# Altium schematic sheet STM32H730_PINOUT.SchDoc
size C; SheetNumber: 5; SheetTotal: 5
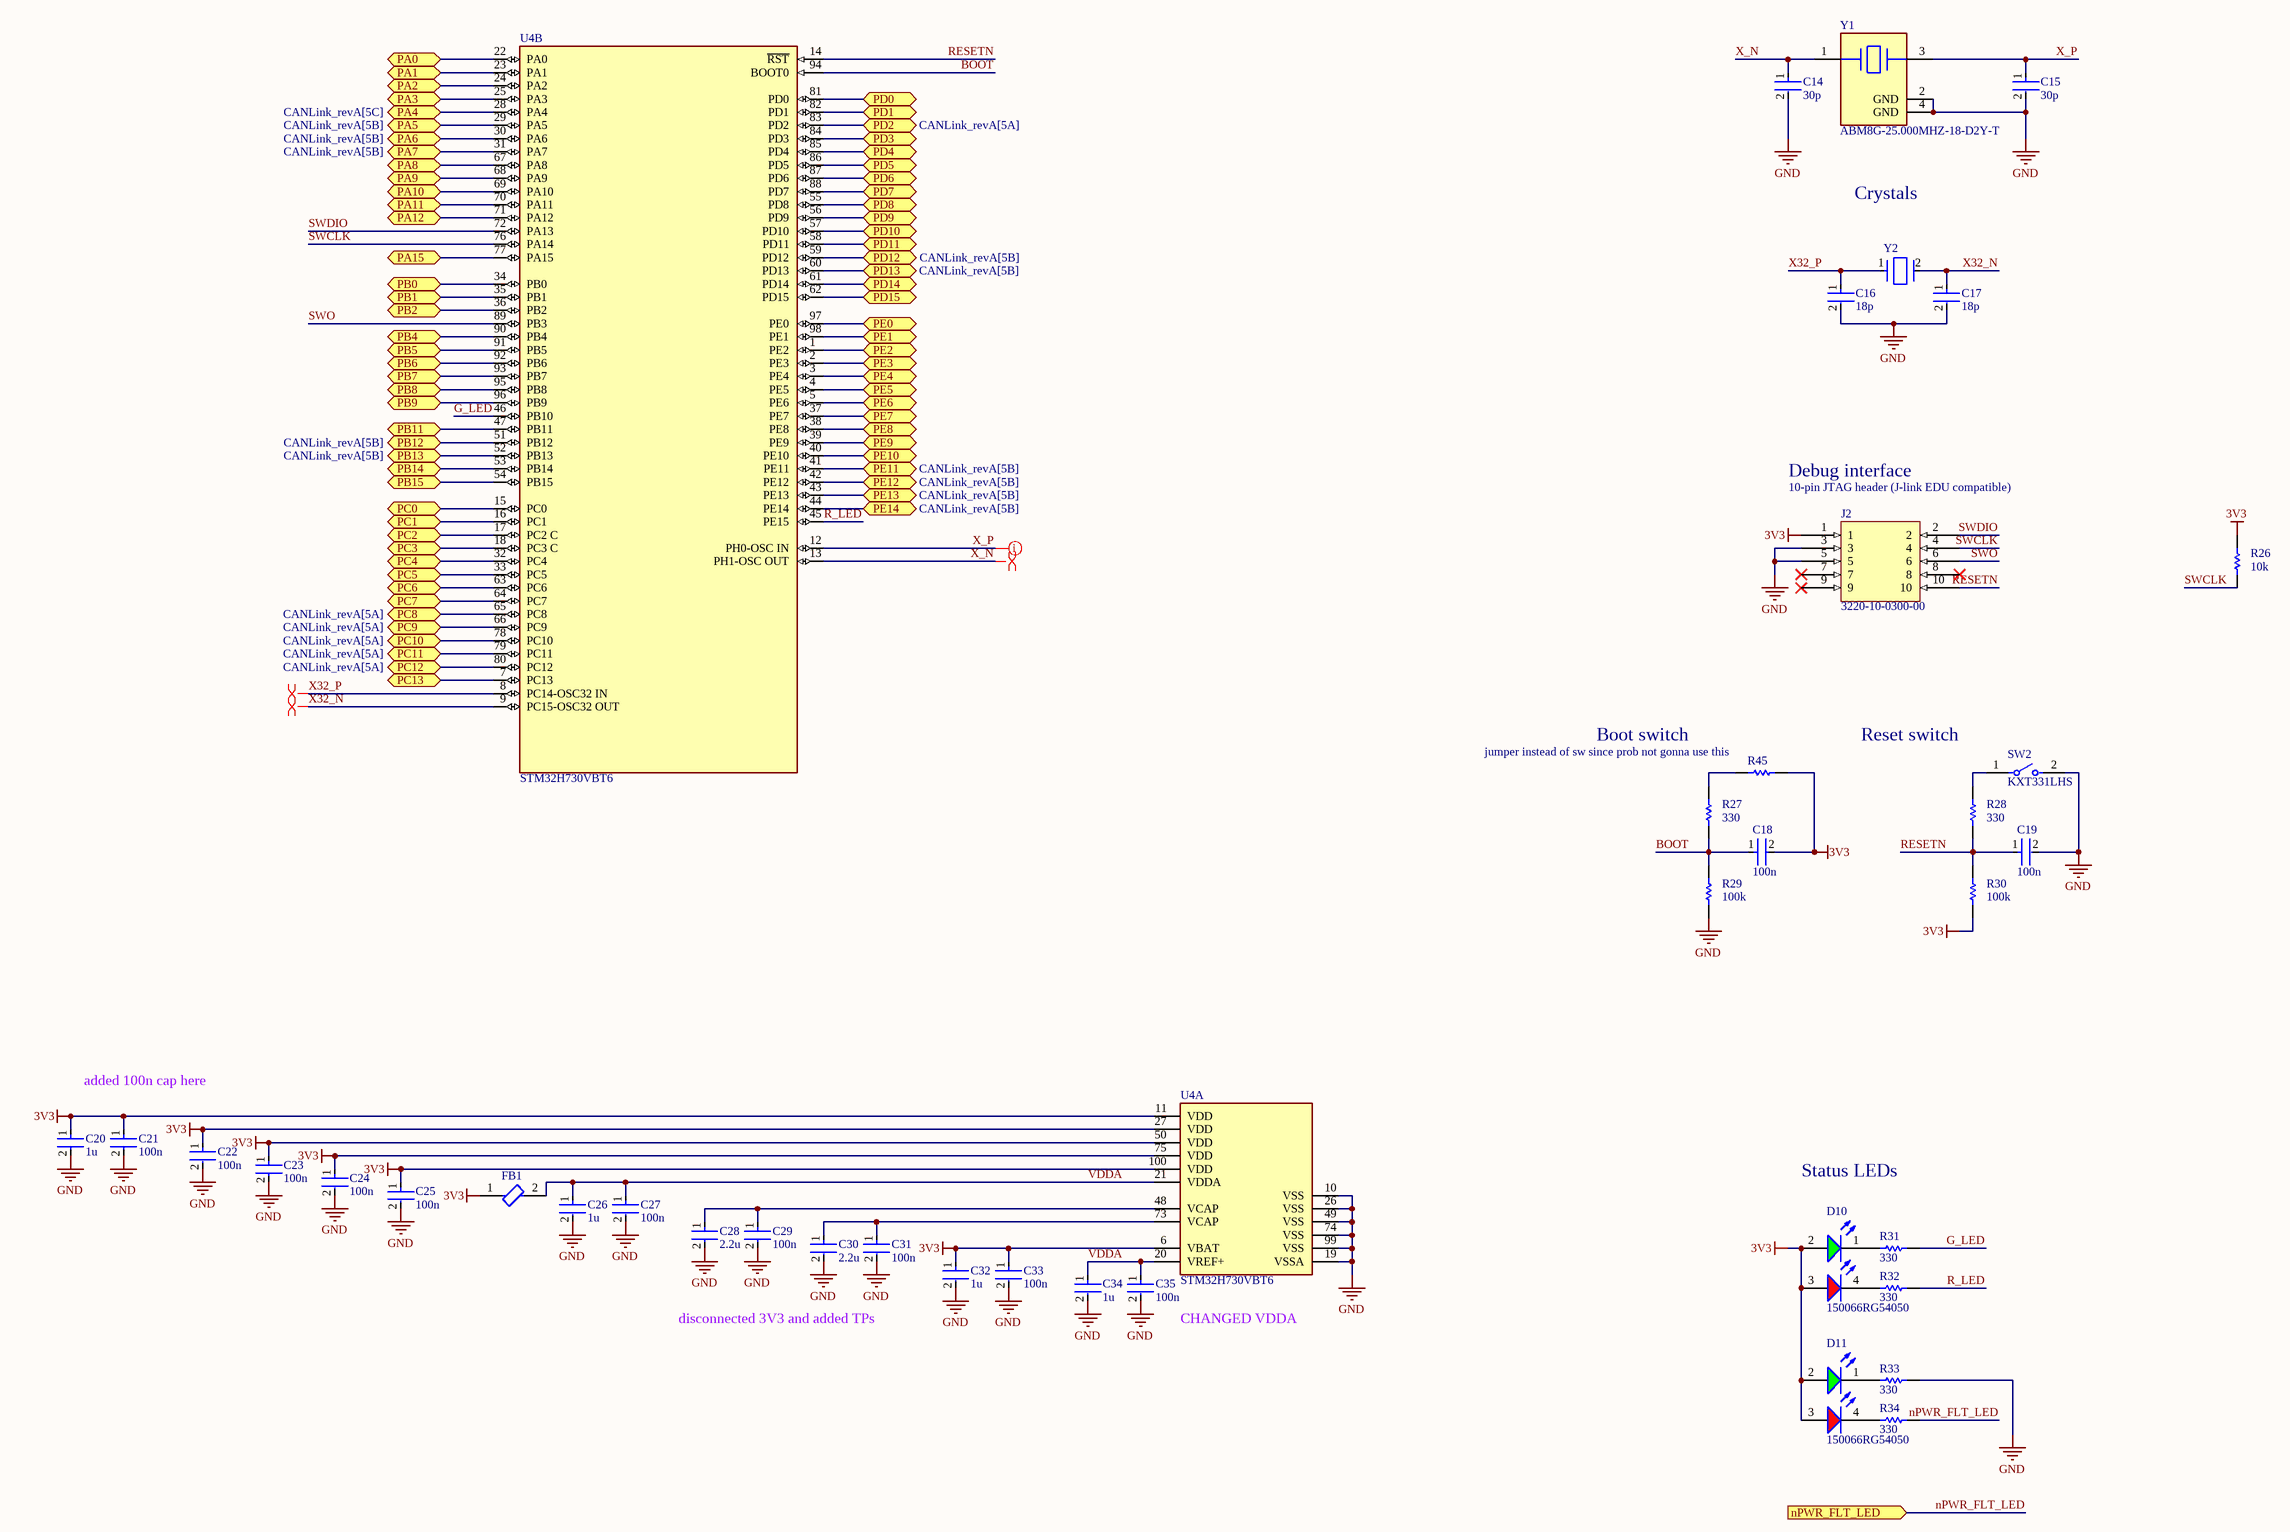
[diagram p0: STM32H730_PINOUT.SchDoc]

## Parts
C14  30p  [FP-0402-L_1_0_0_05-W_0_5-IPC_A]
C15  30p  [FP-0402-L_1_0_0_05-W_0_5-IPC_A]
C16  18p  [FP-0402-L_1_0_0_05-W_0_5-IPC_A]
C17  18p  [FP-0402-L_1_0_0_05-W_0_5-IPC_A]
C18  100n  [FP-0402-L_1_0_0_05-W_0_5-IPC_A]
C19  100n  [FP-0402-L_1_0_0_05-W_0_5-IPC_A]
C20  1u  [FP-0402-L_1_0_0_05-W_0_5-IPC_A]
C21  100n  [FP-0402-L_1_0_0_05-W_0_5-IPC_A]
C22  100n  [FP-0402-L_1_0_0_05-W_0_5-IPC_A]
C23  100n  [FP-0402-L_1_0_0_05-W_0_5-IPC_A]
C24  100n  [FP-0402-L_1_0_0_05-W_0_5-IPC_A]
C25  100n  [FP-0402-L_1_0_0_05-W_0_5-IPC_A]
C26  1u  [FP-0402-L_1_0_0_05-W_0_5-IPC_A]
C27  100n  [FP-0402-L_1_0_0_05-W_0_5-IPC_A]
C28  2.2u  [FP-0402-L_1_0_0_05-W_0_5-IPC_A]
C29  100n  [FP-0402-L_1_0_0_05-W_0_5-IPC_A]
C30  2.2u  [FP-0402-L_1_0_0_05-W_0_5-IPC_A]
C31  100n  [FP-0402-L_1_0_0_05-W_0_5-IPC_A]
C32  1u  [FP-0402-L_1_0_0_05-W_0_5-IPC_A]
C33  100n  [FP-0402-L_1_0_0_05-W_0_5-IPC_A]
C34  1u  [FP-0402-L_1_0_0_05-W_0_5-IPC_A]
C35  100n  [FP-0402-L_1_0_0_05-W_0_5-IPC_A]
D10  150066RG54050  [WL-SBCD_0606]
D11  150066RG54050  [WL-SBCD_0606]
FB1  BLM15PX601SN1D  [FP-BLM15-0_05-IPC_A]  (value not drawn)
J2  3220-10-0300-00  [3220-10-0300-00-Footprint-1]
R26  10k  [R0603B]
R27  330  [R0603B]
R28  330  [R0603B]
R29  100k  [R0603B]
R30  100k  [R0603B]
R31  330  [R0603B]
R32  330  [R0603B]
R33  330  [R0603B]
R34  330  [R0603B]
R45  0402 JUMPER  [RESC1005X40X25ML05T05]  (value not drawn)
SW2  KXT331LHS  [FP-KXT331LHS-MFG]
U4  STM32H730VBT6  [FP-LQFP100-1L-IPC_C]  (parts A,B of 2)
Y1  ABM8G-25.000MHZ-18-D2Y-T  [FP-ABM8G-MFG]
Y2  ECS-.327-12.5-1210-TR  [FP-ECX-1210-MFG]  (value not drawn)

## Ports
nPWR_FLT_LED (in), PA0 (bidir), PA1 (bidir), PA2 (bidir), PA3 (bidir), PA4 (bidir, see CANLink_revA[5C]), PA5 (bidir, see CANLink_revA[5B]), PA6 (bidir, see CANLink_revA[5B]), PA7 (bidir, see CANLink_revA[5B]), PA8 (bidir), PA9 (bidir), PA10 (bidir), PA11 (bidir), PA12 (bidir), PA15 (bidir), PB0 (bidir), PB1 (bidir), PB2 (bidir), PB4 (bidir), PB5 (bidir), PB6 (bidir), PB7 (bidir), PB8 (bidir), PB9 (bidir), PB11 (bidir), PB12 (bidir, see CANLink_revA[5B]), PB13 (bidir, see CANLink_revA[5B]), PB14 (bidir), PB15 (bidir), PC0 (bidir), PC1 (bidir), PC2 (bidir), PC3 (bidir), PC4 (bidir), PC5 (bidir), PC6 (bidir), PC7 (bidir), PC8 (bidir, see CANLink_revA[5A]), PC9 (bidir, see CANLink_revA[5A]), PC10 (bidir, see CANLink_revA[5A]), PC11 (bidir, see CANLink_revA[5A]), PC12 (bidir, see CANLink_revA[5A]), PC13 (bidir), PD0 (bidir), PD1 (bidir), PD2 (bidir, see CANLink_revA[5A]), PD3 (bidir), PD4 (bidir), PD5 (bidir), PD6 (bidir), PD7 (bidir), PD8 (bidir), PD9 (bidir), PD10 (bidir), PD11 (bidir), PD12 (bidir, see CANLink_revA[5B]), PD13 (bidir, see CANLink_revA[5B]), PD14 (bidir), PD15 (bidir), PE0 (bidir), PE1 (bidir), PE2 (bidir), PE3 (bidir), PE4 (bidir), PE5 (bidir), PE6 (bidir), PE7 (bidir), PE8 (bidir), PE9 (bidir), PE10 (bidir), PE11 (bidir, see CANLink_revA[5B]), PE12 (bidir, see CANLink_revA[5B]), PE13 (bidir, see CANLink_revA[5B]), PE14 (bidir, see CANLink_revA[5B])

## Nets
3V3: C18.2 C20.1 C21.1 C22.1 C23.1 C24.1 C25.1 C32.1 C33.1 D10.2(A) D10.3(A) D11.2(A) D11.3(A) FB1.1 J2.1 R26.2 R30.1 R45.2 U4.6(VBAT) U4.11(VDD) U4.27(VDD) U4.50(VDD) U4.75(VDD) U4.100(VDD)
GND: C14.2 C15.2 C16.2 C17.2 C19.2 C20.2 C21.2 C22.2 C23.2 C24.2 C25.2 C26.2 C27.2 C28.2 C29.2 C30.2 C31.2 C32.2 C33.2 C34.2 C35.2 J2.3 J2.5 R29.1 R33.1 SW2.2 U4.10(VSS) U4.19(VSSA) U4.26(VSS) U4.49(VSS) U4.74(VSS) U4.99(VSS) Y1.2(GND) Y1.4(GND)
BOOT: C18.1 R27.1 R29.2 U4.94(BOOT0)
G_LED: R31.1 U4.46(PB10)
nPWR_FLT_LED: R34.1 ; port nPWR_FLT_LED
PA0: U4.22(PA0) ; port PA0
PA1: U4.23(PA1) ; port PA1
PA2: U4.24(PA2) ; port PA2
PA3: U4.25(PA3) ; port PA3
PA4: U4.28(PA4) ; port PA4
PA5: U4.29(PA5) ; port PA5
PA6: U4.30(PA6) ; port PA6
PA7: U4.31(PA7) ; port PA7
PA8: U4.67(PA8) ; port PA8
PA9: U4.68(PA9) ; port PA9
PA10: U4.69(PA10) ; port PA10
PA11: U4.70(PA11) ; port PA11
PA12: U4.71(PA12) ; port PA12
PA15: U4.77(PA15) ; port PA15
PB0: U4.34(PB0) ; port PB0
PB1: U4.35(PB1) ; port PB1
PB2: U4.36(PB2) ; port PB2
PB4: U4.90(PB4) ; port PB4
PB5: U4.91(PB5) ; port PB5
PB6: U4.92(PB6) ; port PB6
PB7: U4.93(PB7) ; port PB7
PB8: U4.95(PB8) ; port PB8
PB9: U4.96(PB9) ; port PB9
PB11: U4.47(PB11) ; port PB11
PB12: U4.51(PB12) ; port PB12
PB13: U4.52(PB13) ; port PB13
PB14: U4.53(PB14) ; port PB14
PB15: U4.54(PB15) ; port PB15
PC0: U4.15(PC0) ; port PC0
PC1: U4.16(PC1) ; port PC1
PC2: U4.17(PC2_C) ; port PC2
PC3: U4.18(PC3_C) ; port PC3
PC4: U4.32(PC4) ; port PC4
PC5: U4.33(PC5) ; port PC5
PC6: U4.63(PC6) ; port PC6
PC7: U4.64(PC7) ; port PC7
PC8: U4.65(PC8) ; port PC8
PC9: U4.66(PC9) ; port PC9
PC10: U4.78(PC10) ; port PC10
PC11: U4.79(PC11) ; port PC11
PC12: U4.80(PC12) ; port PC12
PC13: U4.7(PC13) ; port PC13
PD0: U4.81(PD0) ; port PD0
PD1: U4.82(PD1) ; port PD1
PD2: U4.83(PD2) ; port PD2
PD3: U4.84(PD3) ; port PD3
PD4: U4.85(PD4) ; port PD4
PD5: U4.86(PD5) ; port PD5
PD6: U4.87(PD6) ; port PD6
PD7: U4.88(PD7) ; port PD7
PD8: U4.55(PD8) ; port PD8
PD9: U4.56(PD9) ; port PD9
PD10: U4.57(PD10) ; port PD10
PD11: U4.58(PD11) ; port PD11
PD12: U4.59(PD12) ; port PD12
PD13: U4.60(PD13) ; port PD13
PD14: U4.61(PD14) ; port PD14
PD15: U4.62(PD15) ; port PD15
PE0: U4.97(PE0) ; port PE0
PE1: U4.98(PE1) ; port PE1
PE2: U4.1(PE2) ; port PE2
PE3: U4.2(PE3) ; port PE3
PE4: U4.3(PE4) ; port PE4
PE5: U4.4(PE5) ; port PE5
PE6: U4.5(PE6) ; port PE6
PE7: U4.37(PE7) ; port PE7
PE8: U4.38(PE8) ; port PE8
PE9: U4.39(PE9) ; port PE9
PE10: U4.40(PE10) ; port PE10
PE11: U4.41(PE11) ; port PE11
PE12: U4.42(PE12) ; port PE12
PE13: U4.43(PE13) ; port PE13
PE14: U4.44(PE14) ; port PE14
R_LED: R32.1 U4.45(PE15)
RESETN: C19.1 J2.10 R28.1 R30.2 U4.14(~{RST})
SWCLK: J2.4 R26.1 U4.76(PA14)
SWDIO: J2.2 U4.72(PA13)
SWO: J2.6 U4.89(PB3)
VDDA: C26.1 C27.1 C34.1 C35.1 FB1.2 U4.20(VREF+) U4.21(VDDA)
X32_N: C17.1 U4.9(PC15-OSC32_OUT) Y2.2(Out/In)
X32_P: C16.1 U4.8(PC14-OSC32_IN) Y2.1(In/Out)
X_N: C14.1 U4.13(PH1-OSC_OUT) Y1.1
X_P: C15.1 U4.12(PH0-OSC_IN) Y1.3
NetC28_1: C28.1 C29.1 U4.48(VCAP)
NetC30_1: C30.1 C31.1 U4.73(VCAP)
NetD10_1: D10.1(K) R31.2
NetD10_4: D10.4(K) R32.2
NetD11_1: D11.1(K) R33.2
NetD11_4: D11.4(K) R34.2
NetR27_2: R27.2 R45.1
NetR28_2: R28.2 SW2.1

Not connected (* = marked no-connect by the designer): J2 7* 8* 9*

## Layout directives
differential pair: X32_N, X32_P, X_N, X_P

## Notes on the sheet
- Crystals
- Debug interface
- (near J2) 10-pin JTAG header (J-link EDU compatible)
- Boot switch
- Reset switch
- (near R45) jumper instead of sw since prob not gonna use this
- added 100n cap here
- Status LEDs
- disconnected 3V3 and added TPs
- CHANGED VDDA

## Library data of the parts
C14-C35 = CMP-001-00058-1: LARGE PADS, 0402 CAP, CHANGE COMMENT TO MATCH REAL P/N; Capacitor Type: Ceramic; Min Operating Temperature: -55°C; Mounting Technology: Surface Mount; Pins: 2; Case/Package: 0402; RoHS Compliant: Yes; Max Operating Temperature: 85°C
D10 D11 = CMP-004-00040-2: Led, Red/Grn, 180Mcd/230Mcd, 624Nm/525Nm Rohs Compliant: Yes; Source: rgled.SchLib; Component Type: Standard; Design Item ID: CMP-004-00034-2; Pins: 4
FB1 = CMP-0686-00252-4: Chip Ferrite Bead, 0402, 600Ω @ 100MHz, 0.23Ω, 25%, 900mA; Number of Circuits: 1; Impedance: 600R; DC Resistance (DCR): 230mR; Material: Steel; Length: 1mm; Package Quantity: 10000; Height: 0.5mm; Width: 0.5mm; Max DC Current: 900mA; Number of Lines: 1; Termination: SMD/SMT; Packaging: Tape and Reel; Lead Free: Lead Free; Min Operating Temperature: -55°C; Max Operating Temperature: 125°C; Max Current Rating: 900mA; Case Code (Imperial): 0402; Number of Pins: 2; Current Rating: 900mA; Test Frequency: 100MHz; Case/Package: 0402; Tolerance: 25%; Case Code (Metric): 1005
J2 = CMP-001-0013-3: CONN HEADER SMD 10POS 1.27MM
R26-R34 = CMP-009-00002-14: Resistor
  R26: Value: 10k
  R27 R28 R31-R34: Value: 330
  R29 R30: Value: 100k
R45 = CMP-009-00118-2: READ THE NAME; Pins: 2; Component Type: Standard; Design Item ID: CMP-009-00206-2; Source: 0402jump.SchLib
SW2 = CMP-10040-000029-1: SWITCH TACTILE SPST-NO 0.02A 15V; Operating Force: 240gf; Switch Travel: 0.13mm; Illumination Type: Non-Illuminated; Throw Configuration: SPST; Number of Ports: 1; Current Rating: 5A; Mechanical Life: 500000Cycles; Switch Function: Off-Mom; Connector Type: USB; Actuator Type: Standard; Gender: Receptacle; Number of Contacts: 24; Contact Plating: Gold; Insulation Color: Black; Min Operating Temperature: -40°C; Packaging: Tape and Reel; Flammability Rating: UL94 V-0; Max Operating Temperature: 85°C; Termination: Solder; Mount: Surface Mount
U4 = CMP-12105-000107-1: IC MCU 32BIT 128KB FLASH 100LQFP
Y1 = CMP-2000-05733-3: Crystal 25MHz ±20ppm (Tol) ±30ppm (Stability) 18pF FUND 60Ω 4-Pin SMD T/R; Series Resistance: 60R; Length: 3.2mm; Depth: 2.5mm; Packaging: Tape and Reel; Min Operating Temperature: -40°C; Operating Frequency: 25 MHz; Lead Free: Lead Free; Number of Pins: 4; Frequency Tolerance: 20ppm; Radiation Hardening: No; Max Operating Temperature: 85°C; Termination: SMD/SMT; Frequency Stability: 30ppm; Frequency: 25MHz; Series: ABM8G; Mount: Surface Mount; Package Quantity: 1000; Height: 0.039inch; Width: 0.098inch; Case/Package: CSMD; ESR (Equivalent Series Resistance): 60R; Load Capacitance: 18pF; Tolerance: 20ppm
Y2 = CMP-40224-000006-1: CRYSTAL 32.7680KHZ 12.5PF SMD; Manufacturer: ECS International; Frequency: 32.768kHz; Esr: 90kΩ; Tolerance: 20ppm; Device Class L1: Passive Components; Load Capacitance: 12.5pF; Temperature: -40°C to +85°C; ComponentLink2URL: https://ecsxtal.com/store/pdf/ECX-1210.pdf; Series: ECX-1210; Octopart: https://octopart.com/ecs-.327-12.5-1210-tr-ecs+international-81221340; ComponentLink2Description: Datasheet; Temperature Range Low: -40°C; Digikey Description: CRYSTAL 32.7680KHZ 12.5PF SMD; Lead Free: Yes; RoHS: TRUE; Device Class L3: Crystals; Automotive: No; Category: Crys; Height: 0.5mm; Manufacturer Part Number: ECS-.327-12.5-1210-TR; Temperature Range High: +85°C; Device Class L2: Crystals / Oscillators; Package: ECX-1210